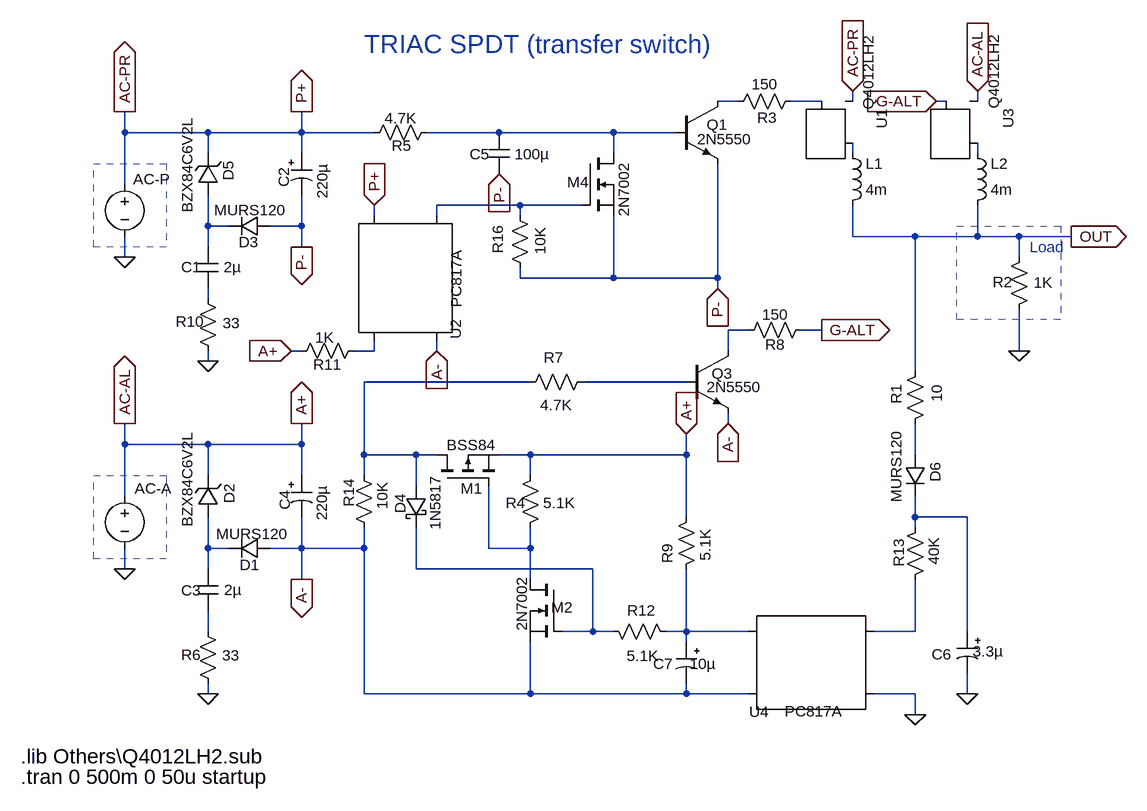
[diagram p0: schematic Simple SPDT Solid State Transfer Switch Using TRIACs (Revisão Ismael).asc]
Simple SPDT Solid State Transfer Switch Using TRIACs (Revisão Ismael).asc, the LTspice schematic file:
Version 4
SHEET 1 2328 992
WIRE 1664 -64 1632 -64
WIRE 1792 -64 1744 -64
WIRE 1840 -64 1840 -80
WIRE 1984 -64 1968 -64
WIRE 2032 -64 2032 -80
WIRE 720 -16 720 -48
WIRE 848 -16 720 -16
WIRE 992 -16 992 -48
WIRE 992 -16 848 -16
WIRE 1104 -16 992 -16
WIRE 1296 -16 1184 -16
WIRE 1472 -16 1296 -16
WIRE 1568 -16 1472 -16
WIRE 848 16 848 -16
WIRE 992 16 992 -16
WIRE 1472 16 1472 -16
WIRE 1840 16 1840 0
WIRE 2032 16 2032 0
WIRE 720 64 720 -16
WIRE 1328 96 1200 96
WIRE 1424 96 1328 96
WIRE 1104 112 1104 96
WIRE 1200 112 1200 96
WIRE 1328 112 1328 96
WIRE 848 128 848 80
WIRE 880 128 848 128
WIRE 992 128 992 80
WIRE 992 128 944 128
WIRE 1840 144 1840 96
WIRE 1936 144 1840 144
WIRE 2032 144 2032 96
WIRE 2032 144 1936 144
WIRE 2096 144 2032 144
WIRE 2176 144 2096 144
WIRE 848 160 848 128
WIRE 992 160 992 128
WIRE 720 176 720 144
WIRE 2096 176 2096 144
WIRE 1328 208 1328 192
WIRE 1472 208 1472 112
WIRE 1472 208 1328 208
WIRE 1632 208 1632 32
WIRE 1632 208 1472 208
WIRE 1632 224 1632 208
WIRE 848 240 848 224
WIRE 1680 288 1648 288
WIRE 1792 288 1760 288
WIRE 992 320 976 320
WIRE 1104 320 1104 304
WIRE 1104 320 1072 320
WIRE 1200 320 1200 304
WIRE 1648 320 1648 288
WIRE 2096 320 2096 256
WIRE 848 336 848 320
WIRE 1936 352 1936 144
WIRE 1344 368 1088 368
WIRE 1584 368 1424 368
WIRE 1648 432 1648 416
WIRE 720 464 720 432
WIRE 848 464 720 464
WIRE 992 464 992 432
WIRE 992 464 848 464
WIRE 1088 480 1088 368
WIRE 1168 480 1088 480
WIRE 1200 480 1168 480
WIRE 1344 480 1296 480
WIRE 1584 480 1584 448
WIRE 1584 480 1344 480
WIRE 1936 480 1936 432
WIRE 848 512 848 464
WIRE 992 512 992 464
WIRE 1088 512 1088 480
WIRE 1344 512 1344 480
WIRE 1168 528 1168 480
WIRE 720 544 720 464
WIRE 1584 576 1584 480
WIRE 1936 576 1936 544
WIRE 2016 576 1936 576
WIRE 1936 592 1936 576
WIRE 848 624 848 576
WIRE 880 624 848 624
WIRE 992 624 992 576
WIRE 992 624 944 624
WIRE 1088 624 1088 592
WIRE 1088 624 992 624
WIRE 1280 624 1280 528
WIRE 1344 624 1344 592
WIRE 1344 624 1280 624
WIRE 720 656 720 624
WIRE 848 656 848 624
WIRE 1168 656 1168 592
WIRE 1440 656 1168 656
WIRE 992 672 992 624
WIRE 1344 672 1344 624
WIRE 848 752 848 720
WIRE 1440 752 1440 656
WIRE 1440 752 1392 752
WIRE 1472 752 1440 752
WIRE 1584 752 1584 656
WIRE 1584 752 1552 752
WIRE 1680 752 1584 752
WIRE 1936 752 1936 672
WIRE 1936 752 1872 752
WIRE 2016 752 2016 576
WIRE 1584 768 1584 752
WIRE 848 848 848 832
WIRE 1088 848 1088 624
WIRE 1344 848 1344 768
WIRE 1344 848 1088 848
WIRE 1584 848 1584 832
WIRE 1584 848 1344 848
WIRE 1680 848 1584 848
WIRE 1936 848 1872 848
WIRE 2016 848 2016 816
WIRE 1936 880 1936 848
FLAG 1104 96 P+
IOPIN 1104 96 In
FLAG 992 432 A+
IOPIN 992 432 Out
FLAG 720 176 0
FLAG 720 656 0
FLAG 2096 320 0
FLAG 992 -48 P+
IOPIN 992 -48 Out
FLAG 992 160 P-
IOPIN 992 160 Out
FLAG 1632 224 P-
IOPIN 1632 224 In
FLAG 992 672 A-
IOPIN 992 672 Out
FLAG 1200 320 A-
IOPIN 1200 320 In
FLAG 976 320 A+
IOPIN 976 320 In
FLAG 1296 48 P-
IOPIN 1296 48 In
FLAG 1936 880 0
FLAG 1584 448 A+
IOPIN 1584 448 In
FLAG 848 336 0
FLAG 848 848 0
FLAG 2176 144 OUT
IOPIN 2176 144 Out
FLAG 720 432 AC-AL
IOPIN 720 432 Out
FLAG 2032 -80 AC-AL
IOPIN 2032 -80 In
FLAG 1792 288 G-ALT
IOPIN 1792 288 Out
FLAG 1968 -64 G-ALT
IOPIN 1968 -64 In
FLAG 2016 848 0
FLAG 1840 -80 AC-PR
IOPIN 1840 -80 In
FLAG 720 -48 AC-PR
IOPIN 720 -48 Out
FLAG 1648 432 A-
IOPIN 1648 432 In
SYMBOL voltage 720 48 R0
WINDOW 3 -151 53 Invisible 2
WINDOW 123 0 0 Left 0
WINDOW 39 0 0 Left 0
WINDOW 0 13 8 Left 2
SYMATTR Value SINE(0 170 60)
SYMATTR InstName AC-P
SYMBOL res 2080 272 M180
WINDOW 0 -25 58 Left 2
WINDOW 3 38 57 Left 2
SYMATTR InstName R2
SYMATTR Value 1K
SYMBOL Misc\\TRIAC 1808 0 M180
WINDOW 0 77 21 VRight 2
WINDOW 3 56 51 VRight 2
SYMATTR InstName U1
SYMATTR Value Q4012LH2
SYMBOL voltage 720 528 R0
WINDOW 3 -235 55 Invisible 2
WINDOW 123 0 0 Left 0
WINDOW 39 0 0 Left 0
WINDOW 0 15 4 Left 2
SYMATTR Value SINE(0 130 60 200m 0 180)
SYMATTR InstName AC-A
SYMBOL cap 832 160 R0
WINDOW 0 -25 31 Left 2
WINDOW 3 40 31 Left 2
SYMATTR InstName C1
SYMATTR Value 2µ
SYMATTR SpiceLine V=250
SYMBOL res 832 224 R0
WINDOW 0 -34 51 Left 2
WINDOW 3 39 53 Left 2
SYMATTR InstName R10
SYMATTR Value 33
SYMBOL diode 944 112 R90
WINDOW 0 56 33 VBottom 2
WINDOW 3 -24 31 VTop 2
SYMATTR InstName D3
SYMATTR Value MURS120
SYMBOL polcap 976 16 R0
WINDOW 0 -11 22 VRight 2
WINDOW 3 48 16 VRight 2
SYMATTR InstName C2
SYMATTR Value 220µ
SYMATTR SpiceLine V=25 Irms=370m Rser=0.24 Lser=0
SYMBOL zener 864 80 R180
WINDOW 0 -15 21 VRight 2
WINDOW 3 48 -27 VRight 2
SYMATTR InstName D5
SYMATTR Value BZX84C6V2L
SYMBOL res 1200 -32 R90
WINDOW 0 52 54 VBottom 2
WINDOW 3 -22 55 VTop 2
SYMATTR InstName R5
SYMATTR Value 4.7K
SYMBOL res 1344 208 R180
WINDOW 0 50 37 VRight 2
WINDOW 3 -15 36 VRight 2
SYMATTR InstName R16
SYMATTR Value 10K
SYMBOL nmos 1424 16 R0
WINDOW 0 -23 44 Left 2
WINDOW 3 64 13 VRight 2
SYMATTR InstName M4
SYMATTR Value 2N7002
SYMBOL npn 1568 -64 R0
WINDOW 0 47 36 Left 2
WINDOW 3 33 58 Left 2
SYMATTR InstName Q1
SYMATTR Value 2N5550
SYMBOL res 1760 -80 R90
WINDOW 0 57 52 VBottom 2
WINDOW 3 -26 55 VTop 2
SYMATTR InstName R3
SYMATTR Value 150
SYMBOL cap 832 656 R0
WINDOW 0 -25 33 Left 2
WINDOW 3 41 32 Left 2
SYMATTR InstName C3
SYMATTR Value 2µ
SYMATTR SpiceLine V=250
SYMBOL res 832 736 R0
WINDOW 0 -25 52 Left 2
WINDOW 3 38 53 Left 2
SYMATTR InstName R6
SYMATTR Value 33
SYMBOL diode 944 608 R90
WINDOW 0 57 32 VBottom 2
WINDOW 3 -22 28 VTop 2
SYMATTR InstName D1
SYMATTR Value MURS120
SYMBOL polcap 976 512 R0
WINDOW 0 -10 23 VRight 2
WINDOW 3 47 15 VRight 2
SYMATTR InstName C4
SYMATTR Value 220µ
SYMATTR SpiceLine V=25 Irms=370m Rser=0.24 Lser=0
SYMBOL zener 864 576 R180
WINDOW 0 -17 20 VRight 2
WINDOW 3 48 -15 VRight 2
SYMATTR InstName D2
SYMATTR Value BZX84C6V2L
SYMBOL res 1440 352 R90
WINDOW 0 -6 60 VBottom 2
WINDOW 3 36 56 VTop 2
SYMATTR InstName R7
SYMATTR Value 4.7K
SYMBOL npn 1584 320 R0
WINDOW 0 39 35 Left 2
WINDOW 3 31 56 Left 2
SYMATTR InstName Q3
SYMATTR Value 2N5550
SYMBOL res 1776 272 R90
WINDOW 0 54 55 VBottom 2
WINDOW 3 -23 55 VTop 2
SYMATTR InstName R8
SYMATTR Value 150
SYMBOL Optos\\PC817A 1152 208 R270
WINDOW 0 -79 77 Center 2
WINDOW 3 -1 78 Center 2
SYMATTR InstName U2
SYMBOL res 1088 304 R90
WINDOW 0 53 56 VBottom 2
WINDOW 3 -20 60 VTop 2
SYMATTR InstName R11
SYMATTR Value 1K
SYMBOL ind 1824 112 M180
WINDOW 0 36 80 Left 2
WINDOW 3 36 40 Left 2
SYMATTR InstName L1
SYMATTR Value 4m
SYMBOL cap 1280 -16 R0
WINDOW 0 -29 33 Left 2
WINDOW 3 40 33 Left 2
SYMATTR InstName C5
SYMATTR Value 100µ
SYMBOL Misc\\TRIAC 2000 0 M180
WINDOW 0 79 22 VRight 2
WINDOW 3 57 53 VRight 2
SYMATTR InstName U3
SYMATTR Value Q4012LH2
SYMBOL pmos 1200 528 R270
WINDOW 0 -4 37 VRight 2
WINDOW 3 63 15 VRight 2
SYMATTR InstName M1
SYMATTR Value BSS84
SYMBOL nmos 1392 672 M0
WINDOW 0 -18 43 Left 2
WINDOW 3 61 79 VLeft 2
SYMATTR InstName M2
SYMATTR Value 2N7002
SYMBOL schottky 1184 528 M0
WINDOW 0 40 43 VLeft 2
WINDOW 3 -14 68 VLeft 2
SYMATTR InstName D4
SYMATTR Value 1N5817
SYMATTR Description Diode
SYMATTR Type diode
SYMBOL res 1328 608 M180
WINDOW 0 -22 54 Left 2
WINDOW 3 36 54 Left 2
SYMATTR InstName R4
SYMATTR Value 5.1K
SYMBOL res 1568 672 M180
WINDOW 0 -13 55 VLeft 2
WINDOW 3 45 78 VLeft 2
SYMATTR InstName R9
SYMATTR Value 5.1K
SYMBOL res 1568 768 M270
WINDOW 0 33 53 VTop 2
WINDOW 3 -6 51 VBottom 2
SYMATTR InstName R12
SYMATTR Value 5.1K
SYMBOL res 1952 576 M0
WINDOW 0 41 77 VLeft 2
WINDOW 3 -13 74 VLeft 2
SYMATTR InstName R13
SYMATTR Value 40K
SYMBOL polcap 2032 752 M0
WINDOW 0 40 35 Left 2
WINDOW 3 -40 31 Left 2
SYMATTR InstName C6
SYMATTR Value 3.3µ
SYMBOL diode 1952 480 M0
WINDOW 0 -15 43 VLeft 2
WINDOW 3 45 74 VLeft 2
SYMATTR InstName D6
SYMATTR Value MURS120
SYMBOL polcap 1600 768 M0
WINDOW 0 36 34 Left 2
WINDOW 3 -30 34 Left 2
SYMATTR InstName C7
SYMATTR Value 10µ
SYMBOL res 1952 336 M0
WINDOW 0 45 67 VLeft 2
WINDOW 3 -17 63 VLeft 2
SYMATTR InstName R1
SYMATTR Value 10
SYMBOL Optos\\PC817A 1776 800 M0
WINDOW 0 80 76 Center 2
WINDOW 3 -4 75 Center 2
SYMATTR InstName U4
SYMBOL res 1104 608 R180
WINDOW 0 39 47 VRight 2
WINDOW 3 -12 43 VRight 2
SYMATTR InstName R14
SYMATTR Value 10K
SYMBOL ind 2016 112 M180
WINDOW 0 36 80 Left 2
WINDOW 3 36 40 Left 2
SYMATTR InstName L2
SYMATTR Value 4m
TEXT 560 944 Left 3 !.lib Others\\Q4012LH2.sub
TEXT 560 976 Left 3 !.tran 0 500m 0 50u startup
TEXT 2112 160 Left 2 ;Load
TEXT 1088 -152 Left 4 ;TRIAC SPDT (transfer switch)
RECTANGLE Normal 784 160 672 32 2
RECTANGLE Normal 784 640 672 512 2
RECTANGLE Normal 2160 272 2000 128 2

The netlist it stands for:
* Simple SPDT Solid State Transfer Switch Using TRIACs (Revisão Ismael).asc
V§AC-P AC-PR 0 SINE(0 170 60)
R2 0 OUT 1K
XU1 N004 N002 AC-PR Q4012LH2  ; pins MT2 G MT1
V§AC-A AC-AL 0 SINE(0 130 60 200m 0 180)
C1 N007 N008 2µ V=250
R10 N008 0 33
D3 P- N007 MURS120
C2 AC-PR P- 220µ V=25 Irms=370m Rser=0.24 Lser=0
D5 N007 AC-PR BZX84C6V2L
R5 N003 AC-PR 4.7K
R16 P- N006 10K
M4 N003 N006 P- P- 2N7002
Q1 N001 N003 P- 0 2N5550
R3 N002 N001 150
C3 N015 N018 2µ V=250
R6 N018 0 33
D1 A- N015 MURS120
C4 AC-AL A- 220µ V=25 Irms=370m Rser=0.24 Lser=0
D2 N015 AC-AL BZX84C6V2L
R7 N012 N011 4.7K
Q3 N009 N012 A- 0 2N5550
R8 G-ALT N009 150
XU2 N010 A- AC-PR N006 PC817 Igain=1m
R11 N010 AC-AL 1K
L1 OUT N004 4m
C5 N003 P- 100µ
XU3 N005 G-ALT AC-AL Q4012LH2  ; pins MT2 G MT1
M1 N011 N016 AC-AL AC-AL BSS84
M2 N016 N017 A- A- 2N7002
D4 N011 N017 1N5817
R4 N016 AC-AL 5.1K
R9 N019 AC-AL 5.1K
R12 N019 N017 5.1K
R13 N014 N020 40K
C6 N014 0 3.3µ
D6 N013 N014 MURS120
C7 N019 A- 10µ
R1 OUT N013 10
XU4 N020 0 N019 A- PC817 Igain=1m
R14 A- N011 10K
L2 OUT N005 4m
.model D D
.lib standard.dio
.model NPN NPN
.model PNP PNP
.lib standard.bjt
.model NMOS NMOS
.model PMOS PMOS
.lib standard.mos
.lib Others\Q4012LH2.sub
.tran 0 500m 0 50u startup
* Load
* TRIAC SPDT (transfer switch)
.lib PC817.sub
.backanno
.end